# Altium schematic sheet SSBtag_ref.SchDoc
size A4
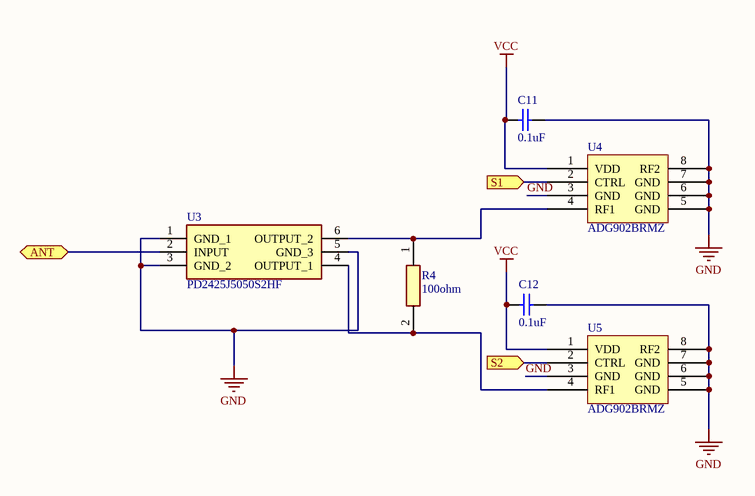
[diagram p0: SSBtag_ref.SchDoc]

## Parts
C11  value 0.1uF  [0402]  (hidden comment: GCM155R71H104KE02D)
C12  value 0.1uF  [0402]  (hidden comment: GCM155R71H104KE02D)
R4  value 100ohm  [RESC1608X55N]  (hidden comment: CRCW0603100RFKEAC)
U3  PD2425J5050S2HF  [PD2425J5050S2HF]
U4  ADG902BRMZ  [ADG902]
U5  ADG902BRMZ  [ADG902]

## Ports
ANT (bidir), S1 (in), S2 (in)

## Nets
GND: C11.2 C12.2 U3.1(GND_1) U3.3(GND_2) U3.5(GND_3) U4.3(GND) U4.5(GND) U4.6(GND) U4.7(GND) U4.8(RF2) U5.3(GND) U5.5(GND) U5.6(GND) U5.7(GND) U5.8(RF2)
VCC: C11.1 C12.1 U4.1(VDD) U5.1(VDD)
ANT: U3.2(INPUT) ; port ANT
S1: U4.2(CTRL) ; port S1
S2: U5.2(CTRL) ; port S2
NetR4_1: R4.1 U3.6(OUTPUT_2) U4.4(RF1)
NetR4_2: R4.2 U3.4(OUTPUT_1) U5.4(RF1)

## Library data of the parts
C11 C12 = Cap: Ceramic Capacitor (Surface Mount); Manufacturer: Generic Ceramic Chip Cap (TBD); Digi-Key Part Number: *; Manufacturer Part Number: *; Note: *; Rating: *
R4 = CRCW0603100RFKEAC: Resistor; Manufacturer_Name: Vishay; Datasheet Link: https://componentsearchengine.com/Datasheets/1/CRCW0603100RFKEAC.pdf; Height: 0.55mm; Manufacturer_Part_Number: CRCW0603100RFKEAC; Mouser Part Number: 71-CRCW0603100RFKEAC; Mouser Price/Stock: https://www.mouser.co.uk/ProductDetail/Vishay-Dale/CRCW0603100RFKEAC?qs=E3Y5ESvWgWPJqb4%2F19sAKw%3D%3D; Arrow Part Number: CRCW0603100RFKEAC; Arrow Price/Stock: https://www.arrow.com/en/products/crcw0603100rfkeac/vishay?region=nac
U3 = PD2425J5050S2HF: Integrated Circuit; Manufacturer_Name: ANAREN; Datasheet Link: https://cdn.anaren.com/product-documents/Xinger/PowerDividers/PD2425J5050S2HF/PD2425J5050S2HF_DataSheet(Rev_A).pdf; Height: 0.58mm; Manufacturer_Part_Number: PD2425J5050S2HF; Mouser Part Number: 620-PD2425J5050S2HF; Mouser Price/Stock: https://www.mouser.co.uk/ProductDetail/Anaren/PD2425J5050S2HF?qs=a9pbqwWPedVRUEtQ0k6YTg%3D%3D
U4 U5 = adg902